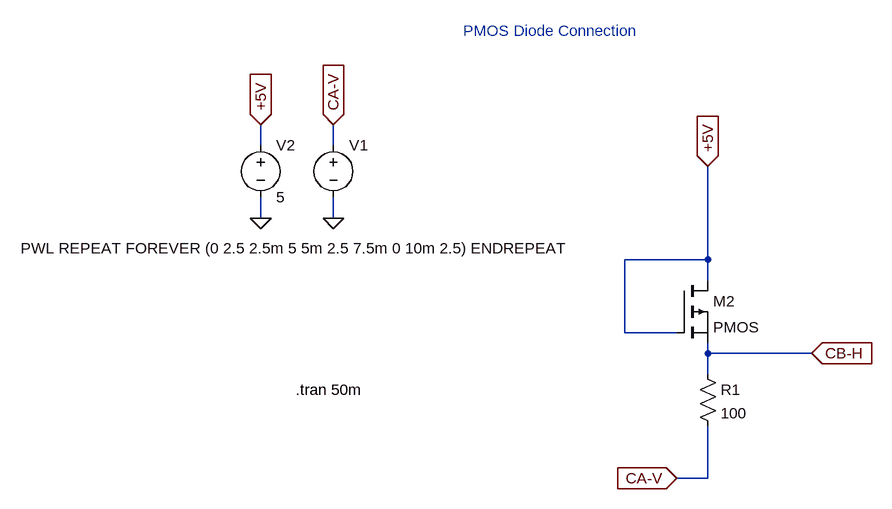
[diagram p0: schematic pmos_diode_conn_ltspice.asc]
pmos_diode_conn_ltspice.asc, the LTspice schematic file:
Version 4
SHEET 1 880 680
WIRE -464 -96 -464 -128
WIRE -352 -96 -352 -128
WIRE -464 16 -464 -16
WIRE -352 16 -352 -16
WIRE 224 80 224 -64
WIRE 224 80 96 80
WIRE 224 112 224 80
WIRE 96 192 96 80
WIRE 176 192 96 192
WIRE 224 224 224 208
WIRE 384 224 224 224
WIRE 224 256 224 224
WIRE 224 416 224 336
WIRE 224 416 176 416
FLAG 176 416 CA-V
IOPIN 176 416 In
FLAG -352 16 0
FLAG -352 -128 CA-V
IOPIN -352 -128 In
FLAG 384 224 CB-H
IOPIN 384 224 In
FLAG 224 -64 +5V
IOPIN 224 -64 In
FLAG -464 16 0
FLAG -464 -128 +5V
IOPIN -464 -128 In
SYMBOL res 208 240 R0
SYMATTR InstName R1
SYMATTR Value 100
SYMBOL voltage -352 -112 R0
WINDOW 3 -481 174 Left 2
WINDOW 123 0 0 Left 0
WINDOW 39 0 0 Left 0
SYMATTR InstName V1
SYMATTR Value PWL REPEAT FOREVER (0 2.5 2.5m 5 5m 2.5 7.5m 0 10m 2.5) ENDREPEAT
SYMBOL pmos 176 112 R0
SYMATTR InstName M2
SYMBOL voltage -464 -112 R0
WINDOW 123 0 0 Left 0
WINDOW 39 0 0 Left 0
SYMATTR InstName V2
SYMATTR Value 5
TEXT -410 280 Left 2 !.tran 50m
TEXT -152 -272 Left 2 ;PMOS Diode Connection

The netlist it stands for:
* pmos_diode_conn_ltspice.asc
R1 CB-H CA-V 100
V1 CA-V 0 PWL REPEAT FOREVER (0 2.5 2.5m 5 5m 2.5 7.5m 0 10m 2.5) ENDREPEAT
M2 +5V +5V CB-H CB-H PMOS
V2 +5V 0 5
.model NMOS NMOS
.model PMOS PMOS
.lib standard.mos
.tran 50m
* PMOS Diode Connection
.backanno
.end